# Altium schematic sheet PAGE04 FPGA CLOCK.SchDoc
size 246 x 182 mm; SheetNumber: 4; SheetTotal: 9
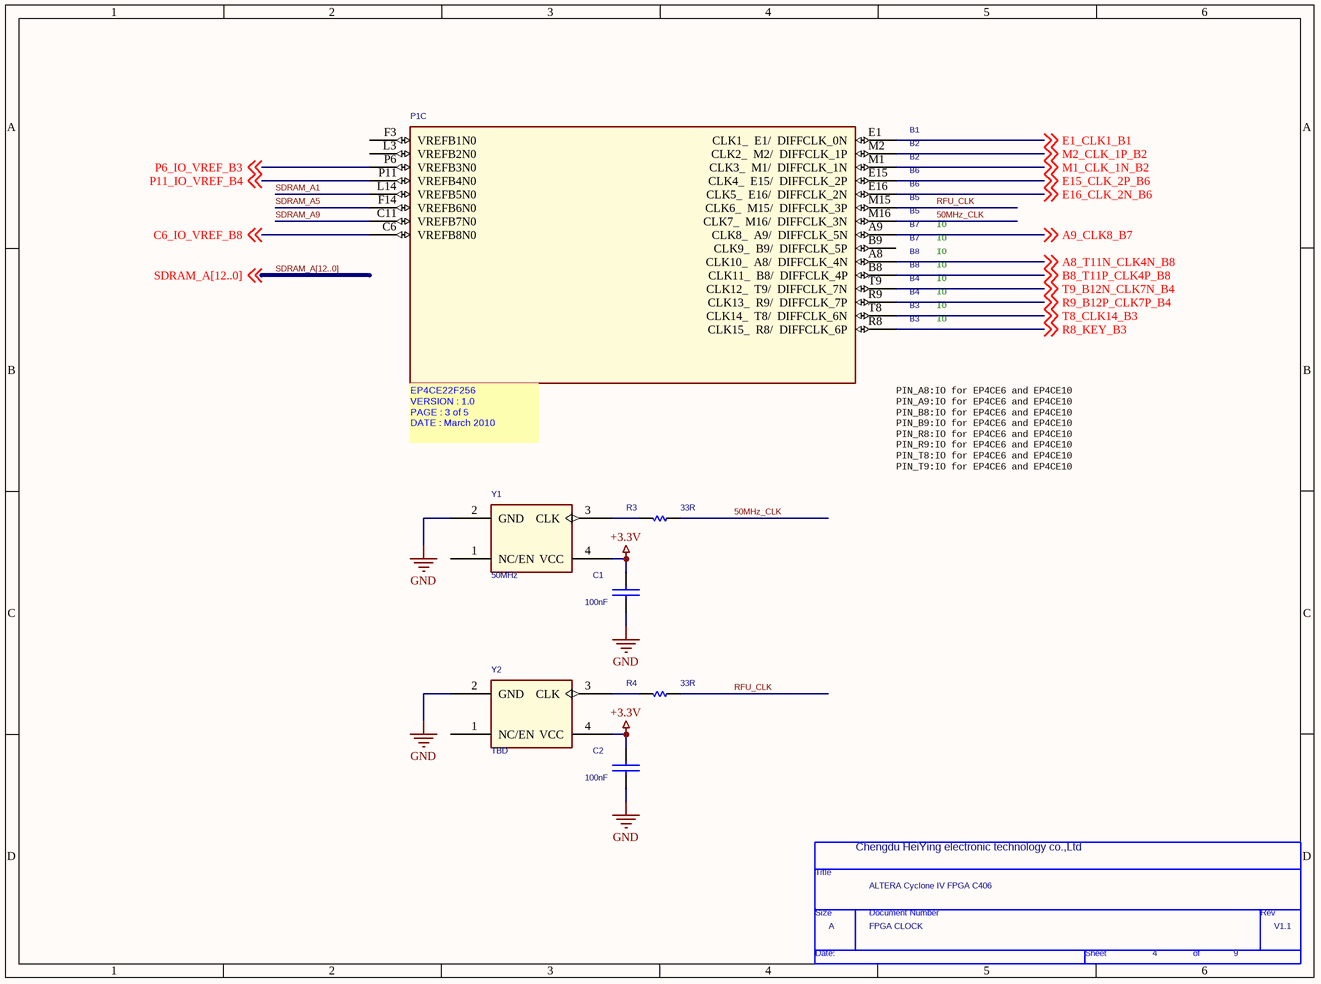
[diagram p0: PAGE04 FPGA CLOCK.SchDoc]

## Parts
*  Page Count: 9  Page Number: 4  Page Size: A  Title: ALTERA Cyclone IV FPGA C406  RevCode: V1.1  Doc: FPGA CLOCK  (hidden comment: TitleBlock0)  (graphical)
C1  100nF  [C0402]
C2  100nF  [C0402]
P1  EP4CE22F256  [fbga256_opt1]  (value not drawn)  (part C of 5)
R3  33R  [R0402]
R4  33R  [R0402]
Y1  50MHz  [OSC3225]
Y2  TBD  [OSC3225]

## Nets
+3.3V: C1.1 C2.1 Y1.4(VCC) Y2.4(VCC)
GND: C1.2 C2.2 Y1.2(GND) Y2.2(GND)
50MHz_CLK: P1.M16(CLK7___M16/__DIFFCLK_3N) R3.1
A8_T11N_CLK4N_B8: P1.A8(CLK10___A8/__DIFFCLK_4N) ; off-sheet A8_T11N_CLK4N_B8
A9_CLK8_B7: P1.A9(CLK8___A9/__DIFFCLK_5N) ; off-sheet A9_CLK8_B7
B8_T11P_CLK4P_B8: P1.B8(CLK11___B8/__DIFFCLK_4P) ; off-sheet B8_T11P_CLK4P_B8
C6_IO_VREF_B8: P1.C6(VREFB8N0) ; off-sheet C6_IO_VREF_B8
E1_CLK1_B1: P1.E1(CLK1___E1/__DIFFCLK_0N) ; off-sheet E1_CLK1_B1
E15_CLK_2P_B6: P1.E15(CLK4___E15/__DIFFCLK_2P) ; off-sheet E15_CLK_2P_B6
E16_CLK_2N_B6: P1.E16(CLK5___E16/__DIFFCLK_2N) ; off-sheet E16_CLK_2N_B6
M1_CLK_1N_B2: P1.M1(CLK3___M1/__DIFFCLK_1N) ; off-sheet M1_CLK_1N_B2
M2_CLK_1P_B2: P1.M2(CLK2___M2/__DIFFCLK_1P) ; off-sheet M2_CLK_1P_B2
P6_IO_VREF_B3: P1.P6(VREFB3N0) ; off-sheet P6_IO_VREF_B3
P11_IO_VREF_B4: P1.P11(VREFB4N0) ; off-sheet P11_IO_VREF_B4
R8_KEY_B3: P1.R8(CLK15___R8/__DIFFCLK_6P) ; off-sheet R8_KEY_B3
R9_B12P_CLK7P_B4: P1.R9(CLK13___R9/__DIFFCLK_7P) ; off-sheet R9_B12P_CLK7P_B4
RFU_CLK: P1.M15(CLK6___M15/__DIFFCLK_3P) R4.1
SDRAM_A1: P1.L14(VREFB5N0)
SDRAM_A5: P1.F14(VREFB6N0)
SDRAM_A9: P1.C11(VREFB7N0)
T8_CLK14_B3: P1.T8(CLK14___T8/__DIFFCLK_6N) ; off-sheet T8_CLK14_B3
T9_B12N_CLK7N_B4: P1.T9(CLK12___T9/__DIFFCLK_7N) ; off-sheet T9_B12N_CLK7N_B4
NetR3_2: R3.2 Y1.3(CLK)
NetR4_2: R4.2 Y2.3(CLK)

Not connected (* = marked no-connect by the designer): P1 B9(CLK9___B9/__DIFFCLK_5P) F3(VREFB1N0) L3(VREFB2N0); Y1 1(NC/EN); Y2 1(NC/EN)

## Buses and harness runs
bus SDRAM_A[12..0]

## Notes on the sheet
- B1
- B2
- B6
- B5
- B7
- B8
- IO
- B4
- B3
- PIN_A8:IO for EP4CE6 and EP4CE10
  PIN_A9:IO for EP4CE6 and EP4CE10
  PIN_B8:IO for EP4CE6 and EP4CE10
  PIN_B9:IO for EP4CE6 and EP4CE10
  PIN_R8:IO for EP4CE6 and EP4CE10
  PIN_R9:IO for EP4CE6 and EP4CE10
  PIN_T8:IO for EP4CE6 and EP4CE10
  PIN_T9:IO for EP4CE6 and EP4CE10
- (near *) Chengdu HeiYing electronic technology co.,Ltd
- (in symbol EP4CE22F256, part C) EP4CE22F256 / VERSION : 1.0 / PAGE : 3 of 5 / DATE : March 2010 /
- (in symbol TitleBlock0) Title; Size; Document Number; Rev; Date:; Sheet; of

## Library data of the parts
C1 C2 = CAP_0: CAP CER .1UF 16V X7R 0402; MANUFACTURER: MURATA; MANUFACTURER P/N: GRM155R71C104KA88D; ROOM: PHY&FPGA; DISTRIBUTOR: DIGIKEY; PRICE: 0.00300; DIELECTRIC: X7R; DISTRIBUTOR P/N: 490-3261-1-ND
P1 = EP4CE22F256: SWAP_INFO: (S1+S2+S3+S4+S5); SPLIT_INST: TRUE
R3 R4 = SMALL R1
Y1 Y2 = OSCILLATOR_0: ROOM: PHY&FPGA
* = TitleBlock0: Page Create Date: March  8, 1995